# Altium schematic sheet FOTA LED Indicators.SchDoc: FOTA MicroController LED Inducators
size 393 x 281 mm; DocumentNumber: 12; SheetNumber: 43; SheetTotal: 43
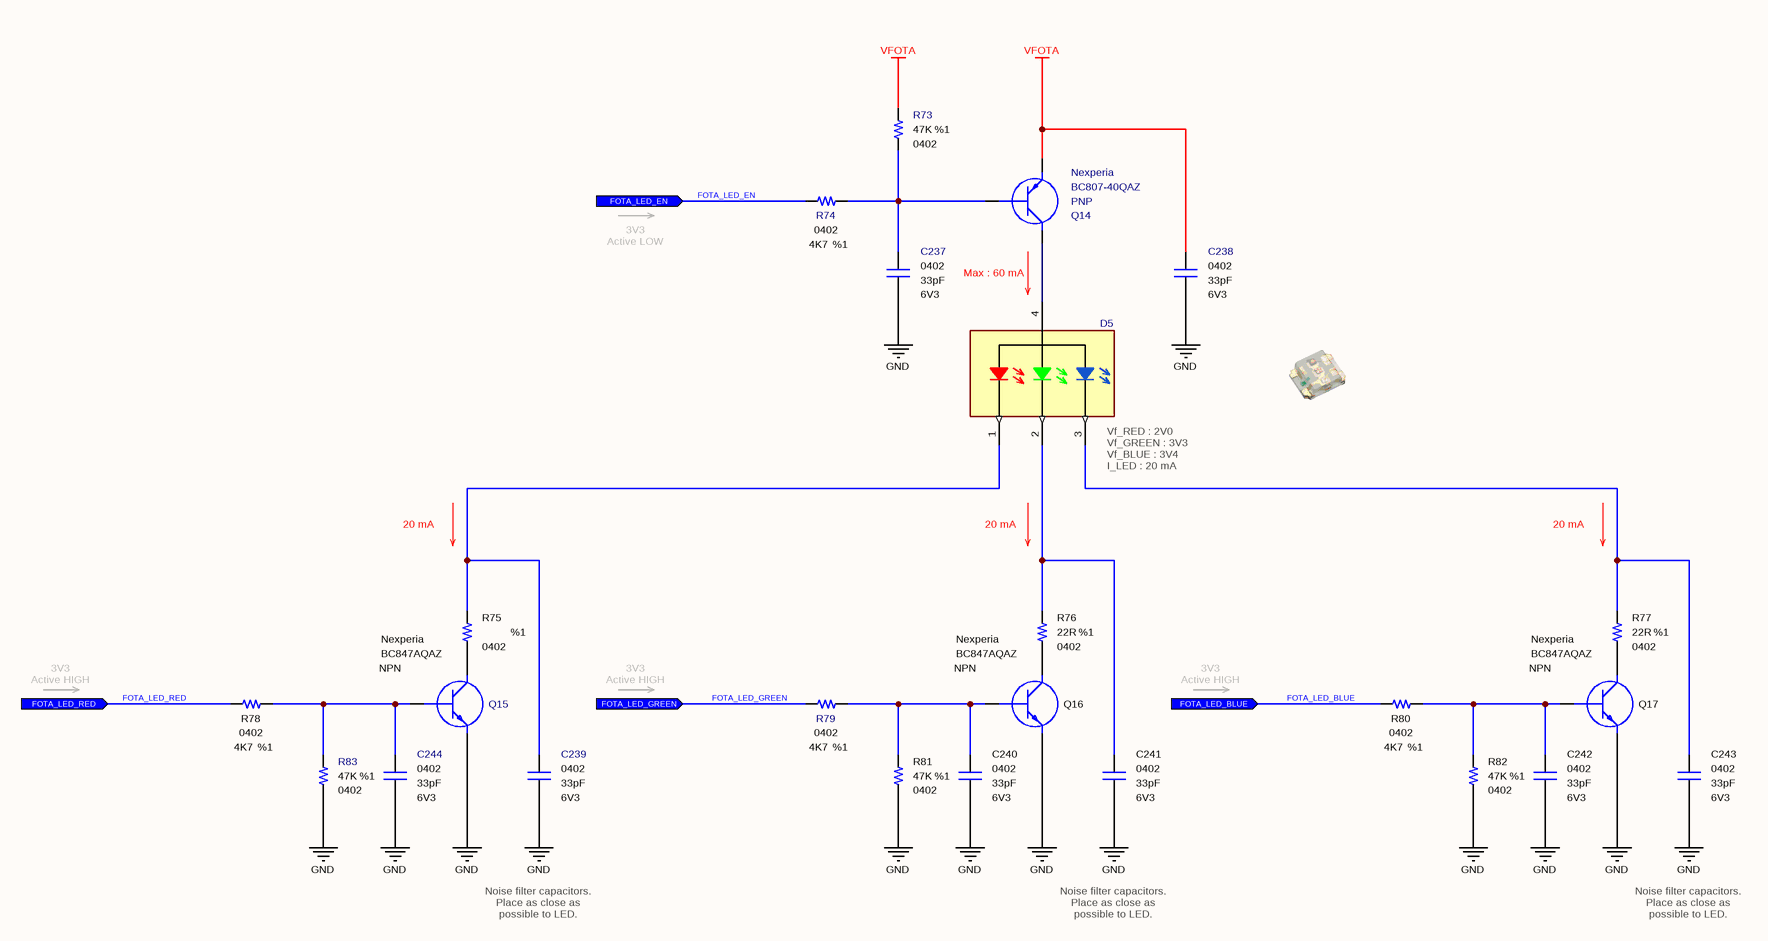
[diagram p0: FOTA LED Indicators.SchDoc]

## Parts
C237  value 33pF  Case: 0402  Voltage: 6V3  [CAPACITOR_0402]  (hidden comment: Multilayer Ceramic Capacitor)
C238  value 33pF  Case: 0402  Voltage: 6V3  [CAPACITOR_0402]  (hidden comment: Multilayer Ceramic Capacitor)
C239  value 33pF  Case: 0402  Voltage: 6V3  [CAPACITOR_0402]  (hidden comment: Multilayer Ceramic Capacitor)
C240  value 33pF  Case: 0402  Voltage: 6V3  [CAPACITOR_0402]  (hidden comment: Multilayer Ceramic Capacitor)
C241  value 33pF  Case: 0402  Voltage: 6V3  [CAPACITOR_0402]  (hidden comment: Multilayer Ceramic Capacitor)
C242  value 33pF  Case: 0402  Voltage: 6V3  [CAPACITOR_0402]  (hidden comment: Multilayer Ceramic Capacitor)
C243  value 33pF  Case: 0402  Voltage: 6V3  [CAPACITOR_0402]  (hidden comment: Multilayer Ceramic Capacitor)
C244  value 33pF  Case: 0402  Voltage: 6V3  [CAPACITOR_0402]  (hidden comment: Multilayer Ceramic Capacitor)
D5  150066M153000  [Wurth_0606]  (value not drawn)
Q14  Polarity: PNP  Manufacturer Name: Nexperia  Manufacturer Part Number: BC807-40QAZ  [SOT1215]  (hidden comment: Bipolar PNP Transistors)
Q15  Polarity: NPN  Manufacturer Name: Nexperia  [SOT1215]  (hidden comment: BC847AQAZ)
Q16  Polarity: NPN  Manufacturer Name: Nexperia  [SOT1215]  (hidden comment: BC847AQAZ)
Q17  Polarity: NPN  Manufacturer Name: Nexperia  [SOT1215]  (hidden comment: BC847AQAZ)
R73  value 47K  Tolerance: %1  Case: 0402  [RESISTOR_0402]  (hidden comment: 47K - 0402 - %1 - 1/16W)
R74  value 4K7  Tolerance: %1  Case: 0402  [RESISTOR_0402]  (hidden comment: Thick Film Resistor)
R75  Tolerance: %1  Case: 0402  [RESISTOR_0402]  (hidden comment: Thick Film Resistor)
R76  value 22R  Tolerance: %1  Case: 0402  [RESISTOR_0402]  (hidden comment: Thick Film Resistor)
R77  value 22R  Tolerance: %1  Case: 0402  [RESISTOR_0402]  (hidden comment: Thick Film Resistor)
R78  value 4K7  Tolerance: %1  Case: 0402  [RESISTOR_0402]  (hidden comment: Thick Film Resistor)
R79  value 4K7  Tolerance: %1  Case: 0402  [RESISTOR_0402]  (hidden comment: Thick Film Resistor)
R80  value 4K7  Tolerance: %1  Case: 0402  [RESISTOR_0402]  (hidden comment: Thick Film Resistor)
R81  value 47K  Tolerance: %1  Case: 0402  [RESISTOR_0402]  (hidden comment: 47K - 0402 - %1 - 1/16W)
R82  value 47K  Tolerance: %1  Case: 0402  [RESISTOR_0402]  (hidden comment: 47K - 0402 - %1 - 1/16W)
R83  value 47K  Tolerance: %1  Case: 0402  [RESISTOR_0402]  (hidden comment: 47K - 0402 - %1 - 1/16W)

## Ports
FOTA_LED_BLUE (in), FOTA_LED_EN (in), FOTA_LED_GREEN (in), FOTA_LED_RED (in)

## Nets
GND: C237.2 C238.2 C239.2 C240.2 C241.2 C242.2 C243.2 C244.2 Q15.2(E) Q16.2(E) Q17.2(E) R81.1 R82.1 R83.1
VFOTA: C238.1 Q14.2(E) R73.2
FOTA_LED_BLUE: R80.2 ; port FOTA_LED_BLUE
FOTA_LED_EN: R74.2 ; port FOTA_LED_EN
FOTA_LED_GREEN: R79.2 ; port FOTA_LED_GREEN
FOTA_LED_RED: R78.2 ; port FOTA_LED_RED
NetC237_1: C237.1 Q14.1(B) R73.1 R74.1
NetC239_1: C239.1 D5.1 R75.2
NetC240_1: C240.1 Q16.1(B) R79.1 R81.2
NetC241_1: C241.1 D5.2 R76.2
NetC242_1: C242.1 Q17.1(B) R80.1 R82.2
NetC243_1: C243.1 D5.3 R77.2
NetC244_1: C244.1 Q15.1(B) R78.1 R83.2
NetD5_4: D5.4 Q14.3(C)
NetQ15_3: Q15.3(C) R75.1
NetQ16_3: Q16.3(C) R76.1
NetQ17_3: Q17.3(C) R77.1

## Notes on the sheet
- 3V3
  Active LOW
- Max : 60 mA
- (near D5) Vf_RED : 2V0
  Vf_GREEN : 3V3
  Vf_BLUE : 3V4
  I_LED : 20 mA
- 20 mA
- 3V3
  Active HIGH
- Noise filter capacitors. Place as close as possible to LED.
- © 2021 All rights reserved.
  This document may not, in whole or in part, be copied, photocopied, reproduced, translated or converted to any electronic or machine readable from without prior written permission of Mehmet Günce Akkoyun.
  Engineer contact : akkoyun@me.com
- Property of
- Engineer :
- Date :
- Size :
- A3
- Time :
- Project :
- Page :
- /
- Customer :
- Product ID :
- Module ID :
- Version :
- File :
- Revision :

## Library data of the parts
C237-C244 = Capacitor - 33pF [0402-6V3]: Capacitor - 33pF [0402] (Ceramic); Manufacturer Name: Kemet; Manufacturer Part Number: C0402C330J9RACAUTO; Dielectric: X7R; Tolerance: 10%; Height: 0.5mm; Maximum Operating Temperature: +125; Minimum Operating Temperature: -55; ROHS: Yes; ComponentLink1Description: DataSheet; ComponentLink1URL: https://api.kemet.com/component-edge/download/datasheet/C0402C330J9RACAUTO.pdf; ComponentLink2Description: Mouser; ComponentLink2URL: https://www.mouser.com/Search/Refine.aspx?Keyword=80-C0402C330J9RAUTO; Supplier 1: Mouser; Supplier Part Number 1: 80-C0402C330J9RAUTO; Mouser Part Number: 80-C0402C330J9RAUTO
D5 = Diode - RGB LED (150066M153000): Standard LEDs - SMD PICOLED series Red LED; Manufacturer Name: Wurth Elektronik; Datasheet Link: https://www.mouser.com.tr/datasheet/2/445/150066M153000-1715259.pdf; Manufacturer Part Number: 150066M153000; Mouser Part Number: 710-150066M153000; Mouser Price/Stock: https://www.mouser.com.tr/ProductDetail/ROHM-Semiconductor/SML-P12U2TT86R?qs=sGAEpiMZZMseGfSY3csMkRIBDsfU3UCXJTULB5gem9Ta%252Bp%252BvZ709fg%3D%3D; Case: 0606; ROHS: Yes; Supplier 1: RSComponents; Supplier 2: RSComponents; Supplier 3: Mouser; Supplier 4: Farnell; Supplier 5: Digi-Key; Supplier 6: Digi-Key; Supplier 7: Digi-Key; Supplier 8: Newark; Supplier Part Number 1: 1765006; Supplier Part Number 2: 1766050; Supplier Part Number 3: 710-150066M153000; Supplier Part Number 4: 2764964; Supplier Part Number 5: 732-11390-1-ND; Supplier Part Number 6: 732-11390-6-ND; Supplier Part Number 7: 732-11390-2-ND; Supplier Part Number 8: 22AC3253
Q14 = Transistor - BC807: Bipolar Transistors - BJT 45 V, 500 mA PNP gen purpose transistors; Mouser Part Number: 771-BC807-40QAZ; ComponentLink1Description: DataSheet; ComponentLink1URL: https://www.mouser.com.tr/datasheet/2/916/BC807-25QA_40QA-1665956.pdf; ComponentLink2Description: Mouser; ComponentLink2URL: https://www.mouser.com.tr/ProductDetail/Nexperia/BC807-40QAZ?qs=sGAEpiMZZMshyDBzk1%2FWi8mfWMj7sMzapbI3Mu1S6AqR9y7krhZTdA%3D%3D; Supplier 1: Mouser; Supplier 2: Arrow; Supplier 3: Digi-Key; Supplier 4: Digi-Key; Supplier Part Number 1: 771-BC807-40QAZ; Supplier Part Number 2: BC807-40QAZ; Supplier Part Number 3: 1727-2242-1-ND; Supplier Part Number 4: 1727-2242-6-ND; Case: DFN-1010D-3
Q15-Q17 = Transistor - BC847: Bipolar NPN Transistors; Case: DFN-1010D-3; Supplier 1: Digi-Key; Supplier 2: Digi-Key; Supplier Part Number 1: 1727-2545-1-ND; Supplier Part Number 2: 1727-2545-6-ND; Manufacturer Part Number: BC847AQAZ; Supplier 3: Avnet; Supplier 4: Arrow Electronics; Supplier 5: Mouser; Supplier 6: Newark; Supplier 7: Digi-Key; Supplier 8: Farnell; Supplier 9: Farnell; Supplier Part Number 3: BC847AQAZ; Supplier Part Number 4: BC847AQAZ; Supplier Part Number 5: 771-BC847AQAZ; Supplier Part Number 6: 82Y6125; Supplier Part Number 7: 1727-2545-2-ND; Supplier Part Number 8: 2545344; Supplier Part Number 9: 2545344RL
R73 R81-R83 = Resistor - 47K: Thick Film Resistors - SMD 1/16 W 47 Kohms 1%; Manufacturer Name: Vishay; Manufacturer Part Number: CRCW040247K0FKED; Height: 0.4mm; ComponentLink1Description: DataSheet; ComponentLink1URL: https://www.mouser.com.tr/datasheet/2/427/dcrcwe3-1762152.pdf; ComponentLink2Description: Mouser; ComponentLink2URL: https://www.mouser.com.tr/ProductDetail/Vishay-Dale/CRCW040247K0FKED?qs=sGAEpiMZZMu61qfTUdNhG2DpbjADlD3GL%252B3h1elTxqU%3D; Supplier 1: RSComponents; Supplier 2: Newark; Supplier Part Number 1: 6789361P; Supplier Part Number 2: 52K7097; Supplier 3: Avnet; Supplier 4: RSComponents; Supplier 5: Future Electronics; Supplier 6: Future Electronics; Supplier 7: Newark; Supplier 8: Arrow Electronics; Supplier 9: Mouser; Supplier 10: Newark; Supplier 11: Avnet; Supplier 12: Digi-Key; Supplier 13: Digi-Key; Supplier 14: Digi-Key; Supplier 15: Newark; Supplier 16: Farnell; Supplier 17: Farnell; Supplier 18: Farnell; Supplier 19: Allied Electronics; Supplier 20: Allied Electronics; Supplier 21: Avnet; Supplier 22: Future Electronics; Supplier 23: Future Electronics; Supplier 24: Future Electronics; Supplier 25: Newark; Supplier 26: RSComponents; Supplier 27: RSComponents; Supplier Part Number 3: 52K7097; Supplier Part Number 4: 6789361; Supplier Part Number 5: 2103738; Supplier Part Number 6: 7521222; Supplier Part Number 7: 42K3500; Supplier Part Number 8: CRCW040247K0FKED; Supplier Part Number 12: 541-47.0KLCT-ND; Supplier Part Number 14: 541-47.0KLTR-ND; Supplier Part Number 10: 61M5310; Supplier Part Number 9: 71-CRCW0402-47K-E3; Supplier Part Number 13: 541-47.0KLDKR-ND; Supplier Part Number 11: CRCW040247K0FKED; Supplier Part Number 15: 25AC7165; Supplier Part Number 16: 1469719; Supplier Part Number 18: 2121814; Supplier Part Number 17: 1469719RL; Supplier Part Number 19: 70202660; Supplier Part Number 20: 70272767; Supplier Part Number 21: 42K3500; Supplier Part Number 22: 6128776; Supplier Part Number 24: CRCW040247K0FKED-REEL; Supplier Part Number 23: CRCW040247K0FKED-CUTT; Supplier Part Number 25: 24W2315; Supplier Part Number 26: 1688455; Supplier Part Number 27: 1823505
R74 R78-R80 = Resistor - 4K7: Thick Film Resistors - SMD 1/16 W 4.7 Kohms 1%; Manufacturer Name: Vishay; Manufacturer Part Number: CRCW04024K70FKED; Height: 0.4mm; Mouser Part Number: 71-CRCW0402-4.7K-E3; ComponentLink1Description: DataSheet; ComponentLink1URL: https://www.mouser.com.tr/datasheet/2/427/dcrcwe3-1762152.pdf; ComponentLink2Description: Mouser; ComponentLink2URL: https://www.mouser.com.tr/ProductDetail/Vishay-Dale/CRCW04024K70FKED?qs=sGAEpiMZZMu61qfTUdNhG7nHf%2F6MTUn3HadIdDQu24Q%3D; Supplier 1: Mouser; Supplier 2: Digi-Key; Supplier Part Number 2: 541-4.70KLCT-ND; Supplier Part Number 1: 71-CRCW0402-4.7K-E3
R75 = Resistor - 64R9: Thick Film Resistors - SMD 1/16 W 64R9 Ohms 1%; Manufacturer Name: Vishay; Manufacturer Part Number: CRCW040264R9FKED; Height: 0.35mm; Mouser Part Number: 71-CRCW0402-64.9-E3; ComponentLink1Description: DataSheet; ComponentLink1URL: https://www.mouser.com.tr/datasheet/2/427/dcrcwe3-1762152.pdf; ComponentLink2Description: Mouser; ComponentLink2URL: https://www.mouser.com.tr/ProductDetail/Vishay-Dale/CRCW040264R9FKED/?qs=DKbL89i6OErClCPxVYdf6Q%3D%3D; Supplier 1: Future Electronics; Supplier 2: Future Electronics; Supplier 3: Mouser; Supplier 4: Farnell; Supplier 5: Digi-Key; Supplier 6: Digi-Key; Supplier 7: Digi-Key; Supplier 8: Newark; Supplier Part Number 1: 8103763; Supplier Part Number 2: 5785985; Supplier Part Number 3: 71-CRCW0402-64.9-E3; Supplier Part Number 4: 2140657; Supplier Part Number 5: 541-64.9LCT-ND; Supplier Part Number 6: 541-64.9LDKR-ND; Supplier Part Number 7: 541-64.9LTR-ND; Supplier Part Number 8: 27W4015
R76 R77 = Resistor - 22R: Thick Film Resistors - SMD 1/16 W 22R Ohms 1%; Manufacturer Name: Vishay; Manufacturer Part Number: CRCW040222R0FKED; Height: 0.35mm; Mouser Part Number: 71-CRCW0402-22-E3; ComponentLink1Description: DataSheet; ComponentLink1URL: https://www.mouser.com.tr/datasheet/2/427/dcrcwe3-1762152.pdf; ComponentLink2Description: Mouser; ComponentLink2URL: https://www.mouser.com.tr/ProductDetail/Vishay-Dale/CRCW040264R9FKED/?qs=DKbL89i6OErClCPxVYdf6Q%3D%3D; Supplier 1: RSComponents; Supplier 2: Avnet; Supplier 3: RSComponents; Supplier 4: Future Electronics; Supplier 5: Arrow Electronics; Supplier Part Number 1: 6788983; Supplier Part Number 2: 52K6847; Supplier Part Number 3: 6788983P; Supplier Part Number 4: 3103732; Supplier Part Number 5: CRCW040222R0FKED